# EAGLE design jha_ssr (EAGLE 6.2)
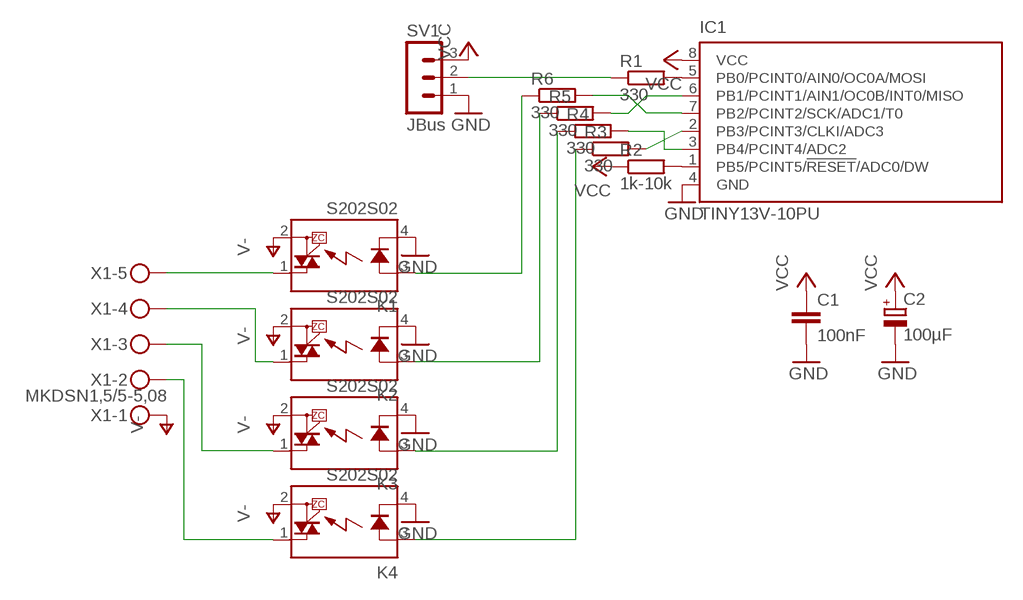
[diagram p0: schematic, sheet 1]

## Parts
C1  100nF  C-EUC0603  [C0603]
C2  100µF  CPOL-EUE2.5-5  [E2,5-5]
IC1  TINY13V-10PU  [DIL08]
K1  S202S02  [S202S02]
K2  S202S02  [S202S02]
K3  S202S02  [S202S02]
K4  S202S02  [S202S02]
R1  330  R-EU_R0805  [R0805]
R2  1k-10k  R-EU_R0805  [R0805]
R3  330  R-EU_R0805  [R0805]
R4  330  R-EU_R0805  [R0805]
R5  330  R-EU_R0805  [R0805]
R6  330  R-EU_R0805  [R0805]
SV1  JBus  MA03-1  [MA03-1]
X1  MKDSN1,5/5-5,08  [MKDSN1,5/5-5,08]

## Nets
GND: C1.2 C2.- IC1.4(GND) K1.4(K) K2.4(K) K3.4(K) K4.4(K) SV1.1
N$1: IC1.5(PB0/PCINT0/AIN0/OC0A/MOSI) R1.2
N$2: R1.1 SV1.2
N$3: IC1.1(PB5/PCINT5/!RESET!/ADC0/DW) R2.2
N$4: IC1.3(PB4/PCINT4/ADC2) R4.2
N$5: IC1.2(PB3/PCINT3/CLKI/ADC3) R3.2
N$6: IC1.6(PB1/PCINT1/AIN1/OC0B/INT0/MISO) R5.2
N$7: IC1.7(PB2/PCINT2/SCK/ADC1/T0) R6.2
N$8: K1.3(A) R6.1
N$9: K2.3(A) R5.1
N$10: K3.3(A) R4.1
N$11: K4.3(A) R3.1
N$12 [230V]: K4.1(DS1) X1.2
N$13 [230V]: K3.1(DS1) X1.3
N$14 [230V]: K2.1(DS1) X1.4
N$15 [230V]: K1.1(DS1) X1.5
V- [230V]: K1.2(DS2) K2.2(DS2) K3.2(DS2) K4.2(DS2) X1.1
VCC: C1.1 C2.+ IC1.8(VCC) R2.1 SV1.3

## Library data of the parts
C1 = rcl:C-EU: CAPACITOR, European symbol
C2 = rcl:CPOL-EU: POLARIZED CAPACITOR, European symbol
IC1 = atmel:TINY13: 8-bit AVR Microcontroller with 1K Bytes In-System Programmable Flash Source: http://www.atmel.com/dyn/resources/prod_documents/2535S.pdf; MPN: ATTINY13V-10PU; OC_FARNELL: 9171576; OC_NEWARK: 96K6523
K1-K4 = relay:S*02S02: IT(rms) 8A, Zero Cross type SIP 4pin Triac output SSR Source: http://sharp-world.com/products/device/lineup/data/pdf/datasheet/s102s02_e.pdf; MPN: S202S02F; OC_FARNELL: 1618475; OC_NEWARK: 14N9588
R1-R6 = rcl:R-EU_: RESISTOR, European symbol
SV1 = con-lstb:MA03-1: PIN HEADER; OC_FARNELL: unknown; OC_NEWARK: unknown
X1 = con-phoenix-508:MKDSN1,5/5-5,08: MKDSN 1,5/ 5-5,08 Printklemme Nennstrom: 13,5 A Nennspannung: 250 V Rastermaß: 5,08 mm Polzahl: 5 Anschlussart: Schraubanschluss Montage: Löten Anschlussrichtung Leiter/Platine: 0 ° Artikelnummer: 1729157 Source: http://eshop.phoenixcontact.com .. 1729157.pdf; MPN: SMKDSN1,5/5-5,08; OC_FARNELL: 1792906; OC_NEWARK: 70R0301

## Net classes
0 5V: width 0.457 mm
1 230V: width 1.016 mm, clearance 1.016 mm

## Board
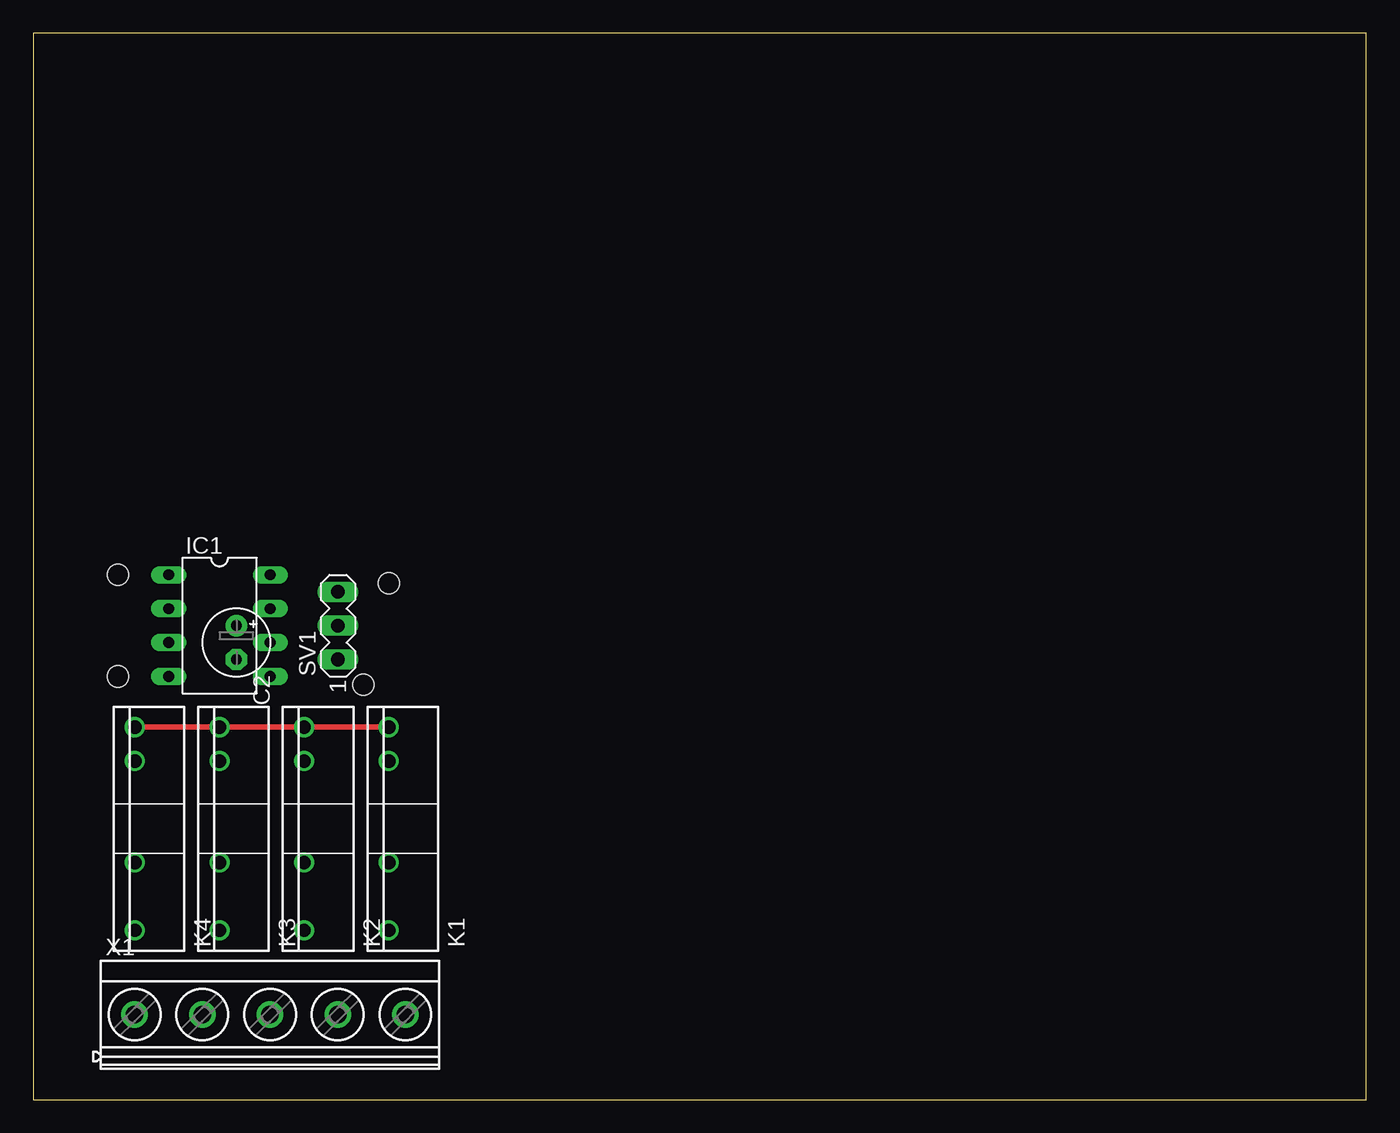
[diagram p1: board, top side]
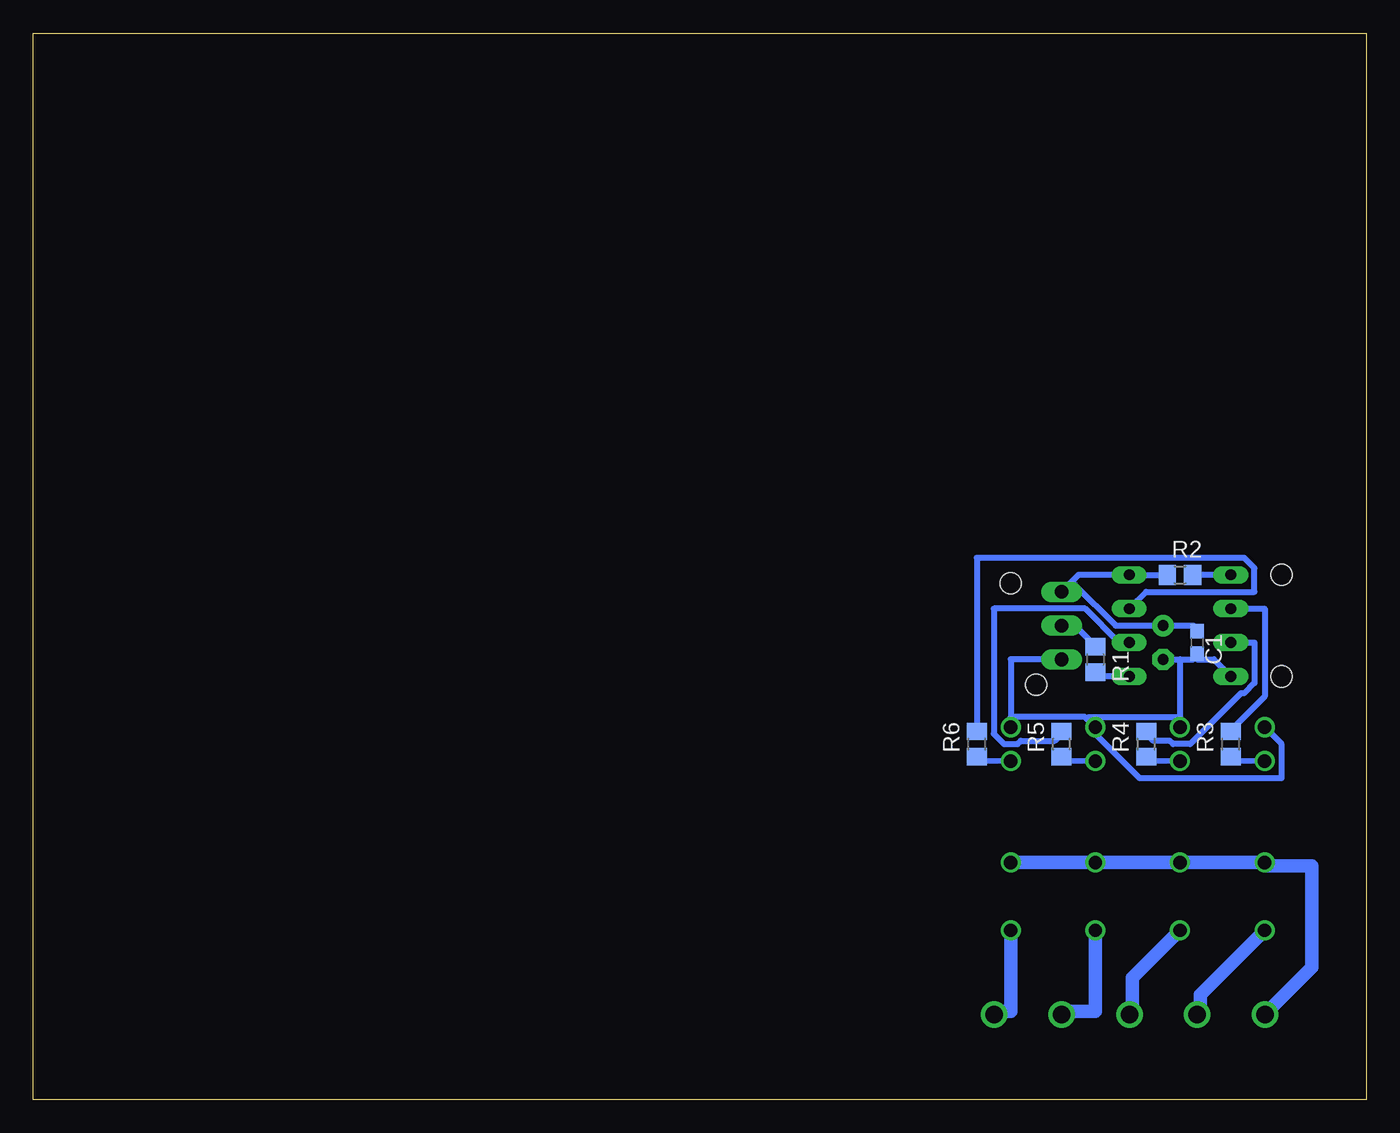
[diagram p2: board, bottom side, seen from below]

Size 100 x 80 mm. Coordinates in mm from the lower left corner, seen from the top.
Outline: 0,0 100,0 100,80 0,80 0,0
Copper layers (1*16): Top 0.035mm / dielectric 1.5mm / Bottom 0.035mm
Design rules: minimum track width 10mil, minimum drill 24mil, track to track 8mil, track to pad 8mil, pad to pad 8mil, via to via 8mil, smd to smd 8mil, copper to edge 40mil, drill to drill 8mil, minimum pad ring 10mil, minimum via ring 8mil, stop-mask expansion 4mil, vias tented up to drill 0mil, thermal gap 10mil
Holes 1.6 mm at 6.35,39.37 6.35,31.75 26.67,38.73 24.77,31.11

### Footprints (pad centres in the part's own frame; a part is rotated, then mirrored left to right if it is on the bottom)
C0603 = smd 1.1 x 1: 1 -0.85,0; 2 0.85,0
E2,5-5 = drill 0.813 pad 1.6: + -1.27,0 | drill 0.813 pad 1.6 octagon: - 1.27,0
DIL08 = drill 0.813 long: 1 -3.81,-3.81; 2 -1.27,-3.81; 3 1.27,-3.81; 4 3.81,-3.81; 5 3.81,3.81; 6 1.27,3.81; 7 -1.27,3.81; 8 -3.81,3.81
S202S02 = drill 1: 1 -7.62,0; 2 -2.54,0; 3 5.08,0; 4 7.62,0
R0805 = smd 1.3 x 1.5: 1 -0.95,0; 2 0.95,0
MA03-1 = drill 1.016 long: 1 -2.54,0; 2 0,0; 3 2.54,0
MKDSN1,5/5-5,08 = drill 1.3 pad 2: 1 -10.181,0.025; 2 -5.101,0.025; 3 -0.021,0.025; 4 5.059,0.025; 5 10.139,0.025

### Placement (x,y rotation side)
C1  12.7,34.29 270 bottom
C2  15.24,34.29 270 top
IC1  13.97,35.56 270 top
K1  26.67,20.32 90 top
K2  20.32,20.32 90 top
K3  13.97,20.32 90 top
K4  7.62,20.32 90 top
R1  20.32,33.02 270 bottom
R2  13.97,39.37 0 bottom
R3  10.16,26.67 90 bottom
R4  16.51,26.67 90 bottom
R5  22.86,26.67 90 bottom
R6  29.21,26.67 90 bottom
SV1  22.86,35.56 90 top
X1  17.78,6.35 0 top

### Tracks (layer width: path | path; a pad name or v marks a point on that pad's centre or on a via)
GND
  Top 0.406: K4.4 K1.4
  Bottom 0.457: C2.- 13.97,33.02 | 13.97,33.02 12.95,33.02 12.7,33.27 C1.2 12.7,33.02 11.43,33.02 IC1.4 | 13.97,33.02 13.97,28.7 | 13.97,28.7 K3.4 | 26.67,28.7 26.67,33.02 SV1.1 | 26.67,28.7 K1.4 | K4.4 6.35,26.67 6.35,24.13 17.02,24.13 20.32,27.43 K2.4 20.95,28.57 | 26.67,28.7 21.08,28.7 20.95,28.57 | 13.97,28.7 20.83,28.7 20.95,28.57
N$1
  Bottom 0.457: IC1.5 20.07,31.75 20.32,32 R1.2
N$2
  Bottom 0.457: SV1.2 21.84,35.56 20.32,34.04 R1.1
N$3
  Bottom 0.457: IC1.1 R2.2
N$4
  Bottom 0.457: IC1.3 8.38,34.29 8.38,31.24 9.14,30.48 9.4,30.48 13.21,26.67 14.48,26.67 14.73,26.92 16,26.92 16.51,27.43 R4.2
N$5
  Bottom 0.457: IC1.2 7.62,36.83 7.62,30.23 10.16,27.69 R3.2
N$6
  Bottom 0.457: IC1.6 18.54,34.29 21.08,36.83 27.94,36.83 27.94,27.43 27.18,26.67 26.16,26.67 25.91,26.92 23.37,26.92 22.86,27.43 R5.2
N$7
  Bottom 0.457: R6.2 29.21,40.64 9.14,40.64 8.38,39.88 8.38,38.1 16.51,38.1 IC1.7
N$8
  Bottom 0.406: K1.3 29.21,25.4
  Bottom 0.457: 29.21,25.4 R6.1
N$9
  Bottom 0.406: K2.3 22.86,25.4
  Bottom 0.457: 22.86,25.4 R5.1
N$10
  Bottom 0.406: K3.3 16.51,25.4
  Bottom 0.457: 16.51,25.4 R4.1
N$11
  Bottom 0.406: K4.3 10.16,25.4
  Bottom 0.457: 10.16,25.4 R3.1
N$12
  Bottom 1.016: K4.1 12.45,7.87 12.45,6.6 X1.2
N$13
  Bottom 1.016: K3.1 17.53,9.14 17.53,6.6 X1.3
N$14
  Bottom 1.016: K2.1 20.32,6.6 22.61,6.6 X1.4
N$15
  Bottom 1.016: K1.1 26.67,6.6 27.69,6.6 X1.5
V-
  Bottom 1.016: K1.2 K2.2 K3.2 K4.2 7.37,17.53 4.06,17.53 4.06,9.91 7.37,6.6 X1.1
VCC
  Bottom 0.457: C1.1 12.7,35.31 12.95,35.56 C2.+ 18.8,35.56 21.84,38.61 22.1,38.61 SV1.3 21.59,39.37 IC1.8 R2.1